# Altium schematic sheet lisa_mx_s_quad.SchDoc
size A4
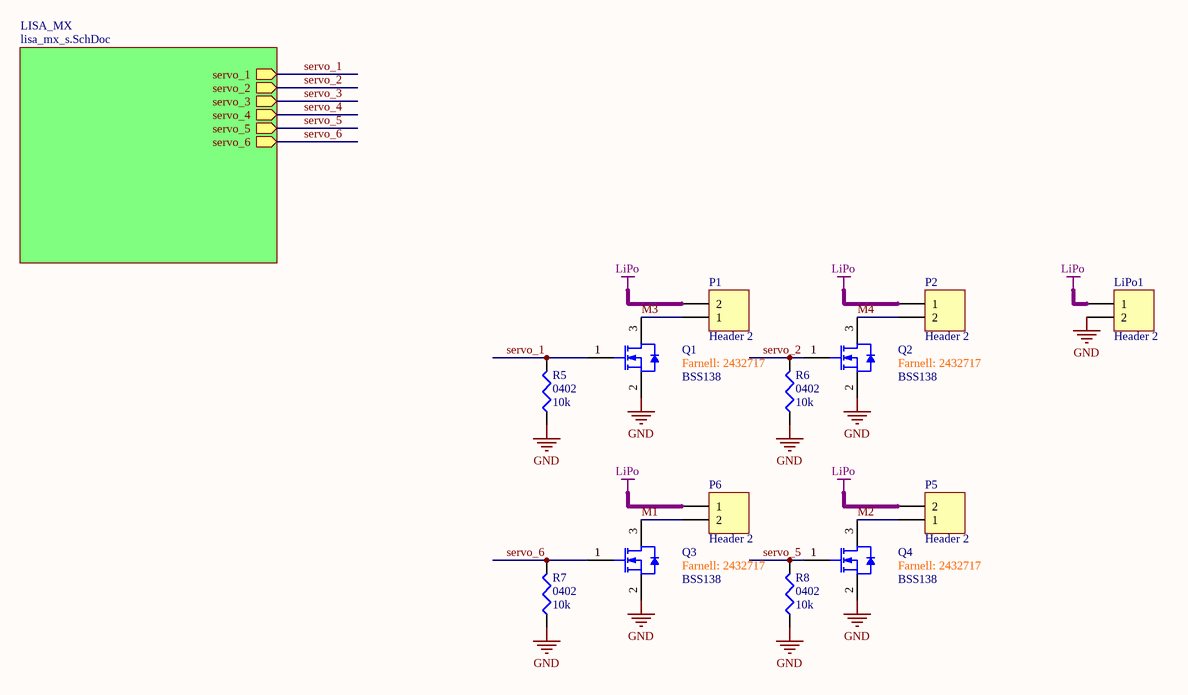
[diagram p0: lisa_mx_s_quad.SchDoc]

## Parts
LiPo1  Header 2  [PICOBLADE_53047-0210]
P1  Header 2  [PICOBLADE_53047-0210]
P2  Header 2  [PICOBLADE_53047-0210]
P5  Header 2  [PICOBLADE_53047-0210]
P6  Header 2  [PICOBLADE_53047-0210]
Q1  value BSS138  Farnell: 2432717  [SOT23A_CDW]  (hidden comment: N-FET)
Q2  value BSS138  Farnell: 2432717  [SOT23A_CDW]  (hidden comment: N-FET)
Q3  value BSS138  Farnell: 2432717  [SOT23A_CDW]  (hidden comment: N-FET)
Q4  value BSS138  Farnell: 2432717  [SOT23A_CDW]  (hidden comment: N-FET)
R5  0402  value 10k  [V0402RES]
R6  0402  value 10k  [V0402RES]
R7  0402  value 10k  [V0402RES]
R8  0402  value 10k  [V0402RES]

## Sub-sheets
LISA_MX = lisa_mx_s.SchDoc: servo_1 (out), servo_2 (out), servo_3 (out), servo_4 (out), servo_5 (out), servo_6 (out)

## Nets
GND: LiPo1.2 Q1.2(S) Q2.2(S) Q3.2(S) Q4.2(S) R5.1 R6.1 R7.1 R8.1
LiPo: LiPo1.1 P1.2 P2.1 P5.2 P6.1
M1: P6.2 Q3.3(D)
M2: P5.1 Q4.3(D)
M3: P1.1 Q1.3(D)
M4: P2.2 Q2.3(D)
servo_1: Q1.1(G) R5.2 ; sheet LISA_MX/servo_1
servo_2: Q2.1(G) R6.2 ; sheet LISA_MX/servo_2
servo_3: sheet LISA_MX/servo_3
servo_4: sheet LISA_MX/servo_4
servo_5: Q4.1(G) R8.2 ; sheet LISA_MX/servo_5
servo_6: Q3.1(G) R7.2 ; sheet LISA_MX/servo_6

## Library data of the parts
LiPo1 P1 P2 P5 P6 = Header 2: Header, 2-Pin
Q1-Q4 = BSS138: Case: SOT23A
R5-R8 = Res3: Resistor; Case: 0402; farnell: 9241000